# EAGLE design Programmer Board v1 Tests (EAGLE 9.4.2)
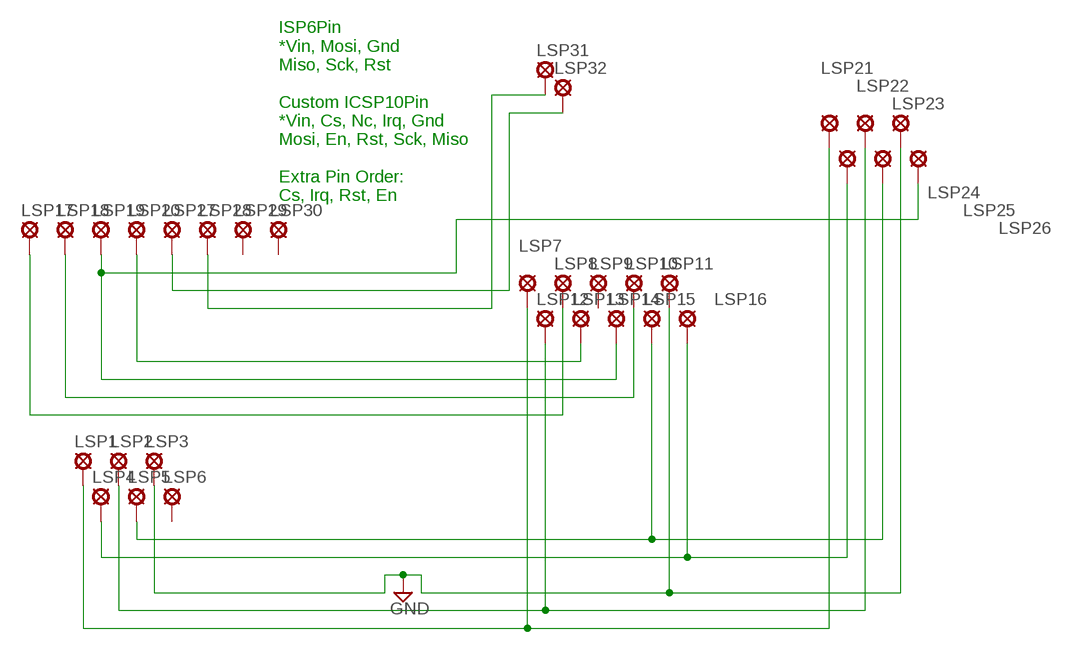
[diagram p0: schematic, sheet 1]

## Parts
LSP1  LSP10_CLSP10_C  [LSP10_C]
LSP2  LSP10_CLSP10_C  [LSP10_C]
LSP3  LSP10_CLSP10_C  [LSP10_C]
LSP4  LSP10_CLSP10_C  [LSP10_C]
LSP5  LSP10_CLSP10_C  [LSP10_C]
LSP6  LSP10_CLSP10_C  [LSP10_C]
LSP7  LSP10_CLSP10_C  [LSP10_C]
LSP8  LSP10_CLSP10_C  [LSP10_C]
LSP9  LSP10_CLSP10_C  [LSP10_C]
LSP10  LSP10_CLSP10_C  [LSP10_C]
LSP11  LSP10_CLSP10_C  [LSP10_C]
LSP12  LSP10_CLSP10_C  [LSP10_C]
LSP13  LSP10_CLSP10_C  [LSP10_C]
LSP14  LSP10_CLSP10_C  [LSP10_C]
LSP15  LSP10_CLSP10_C  [LSP10_C]
LSP16  LSP10_CLSP10_C  [LSP10_C]
LSP17  LSP10_CLSP10_C  [LSP10_C]
LSP18  LSP10_CLSP10_C  [LSP10_C]
LSP19  LSP10_CLSP10_C  [LSP10_C]
LSP20  LSP10_CLSP10_C  [LSP10_C]
LSP21  LSP10_CLSP10_C  [LSP10_C]
LSP22  LSP10_CLSP10_C  [LSP10_C]
LSP23  LSP10_CLSP10_C  [LSP10_C]
LSP24  LSP10_CLSP10_C  [LSP10_C]
LSP25  LSP10_CLSP10_C  [LSP10_C]
LSP26  LSP10_CLSP10_C  [LSP10_C]
LSP27  LSP10_CLSP10_C  [LSP10_C]
LSP28  LSP10_CLSP10_C  [LSP10_C]
LSP29  LSP10_CLSP10_C  [LSP10_C]
LSP30  LSP10_CLSP10_C  [LSP10_C]
LSP31  LSP10_CLSP10_C  [LSP10_C]
LSP32  LSP10_CLSP10_C  [LSP10_C]

## Nets
GND: LSP3.P$1(MP) LSP11.P$1(MP) LSP23.P$1(MP)
N$1: LSP1.P$1(MP) LSP7.P$1(MP) LSP21.P$1(MP)
N$2: LSP2.P$1(MP) LSP12.P$1(MP) LSP22.P$1(MP)
N$3: LSP27.P$1(MP) LSP32.P$1(MP)
N$4: LSP4.P$1(MP) LSP16.P$1(MP) LSP24.P$1(MP)
N$5: LSP5.P$1(MP) LSP15.P$1(MP) LSP25.P$1(MP)
N$6: LSP13.P$1(MP) LSP20.P$1(MP)
N$7: LSP14.P$1(MP) LSP19.P$1(MP) LSP26.P$1(MP)
N$8: LSP10.P$1(MP) LSP18.P$1(MP)
N$9: LSP8.P$1(MP) LSP17.P$1(MP)
N$10: LSP28.P$1(MP) LSP31.P$1(MP)
Unconnected: LSP6.P$1(MP) LSP9.P$1(MP) LSP29.P$1(MP) LSP30.P$1(MP)

## Notes on the sheet
- ISP6Pin
  *Vin, Mosi, Gnd
  Miso, Sck, Rst
  
  Custom ICSP10Pin
  *Vin, Cs, Nc, Irq, Gnd
  Mosi, En, Rst, Sck, Miso
  
  Extra Pin Order:
  Cs, Irq, Rst, En

## Library data of the parts
LSP1-LSP32 = tbtaco-solpad:LSP10_C: SOLDER PAD drill 1.0 mm, distributor Buerklin, 12H555

## Board
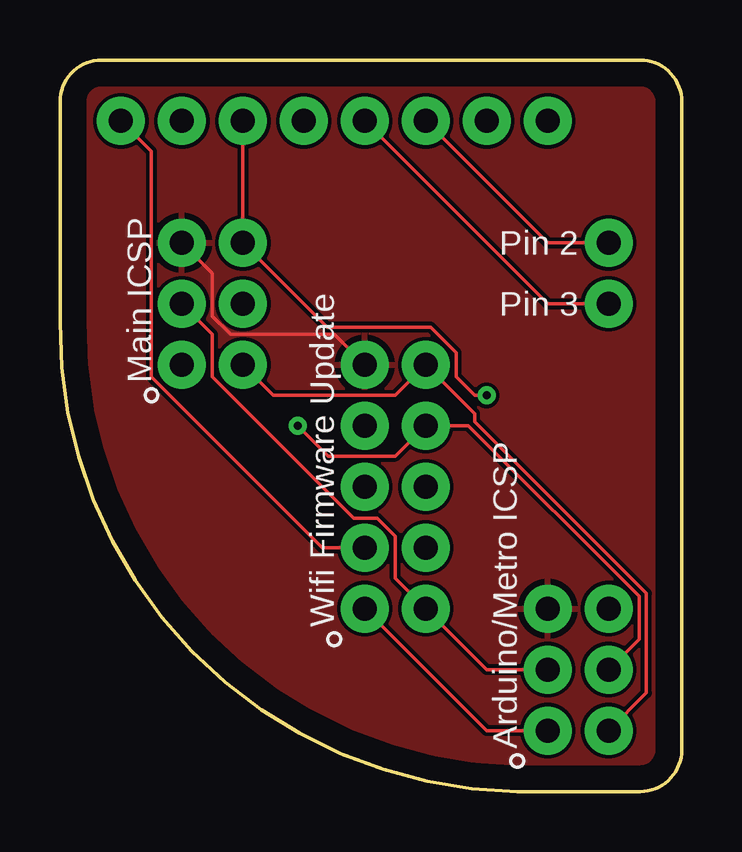
[diagram p1: board, top side]
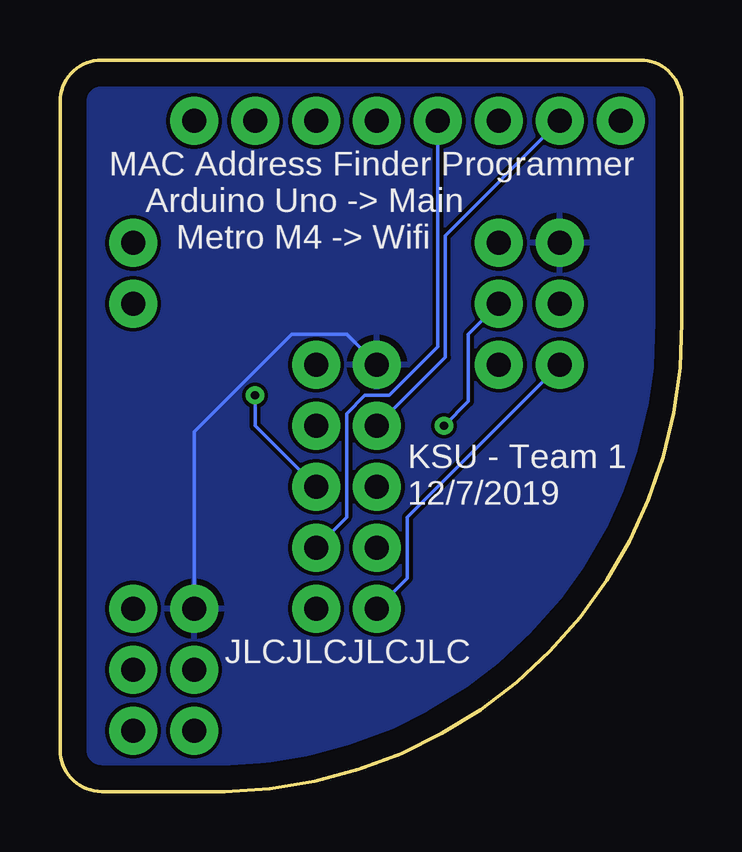
[diagram p2: board, bottom side, seen from below]

Size 25.91 x 30.48 mm. Coordinates in mm from the lower left corner, seen from the top.
Outline: 1.73,30.48 24.17,30.48 arc-90 25.91,28.75 25.91,1.73 arc-90 24.17,0 19.05,0 arc-90 0,19.56 0,28.75 arc-90 1.73,30.48
Copper layers (1*16): Top 0.035mm / dielectric 1.5mm / Bottom 0.035mm
Design rules "default": minimum track width 6mil, minimum drill 0.35mm, track to track 6mil, track to pad 6mil, pad to pad 6mil, via to via 6mil, smd to smd 6mil, copper to edge 40mil, drill to drill 6mil, minimum pad ring 10mil, minimum via ring 8mil, stop-mask expansion 4mil, vias tented up to drill 0mil, thermal gap 10mil

### Footprints (pad centres in the part's own frame; a part is rotated, then mirrored left to right if it is on the bottom)
LSP10_C = drill 1 pad 2: P$1 0,0

### Placement (x,y rotation side)
LSP1  20.32,2.54 0 top
LSP2  20.32,5.08 0 top
LSP3  20.32,7.62 0 top
LSP4  22.86,2.54 0 top
LSP5  22.86,5.08 0 top
LSP6  22.86,7.62 0 top
LSP7  12.7,7.62 0 top
LSP8  12.7,10.16 0 top
LSP9  12.7,12.7 0 top
LSP10  12.7,15.24 0 top
LSP11  12.7,17.78 0 top
LSP12  15.24,7.62 0 top
LSP13  15.24,10.16 0 top
LSP14  15.24,12.7 0 top
LSP15  15.24,15.24 0 top
LSP16  15.24,17.78 0 top
LSP17  2.54,27.94 0 top
LSP18  5.08,27.94 0 top
LSP19  7.62,27.94 0 top
LSP20  10.16,27.94 0 top
LSP21  5.08,17.78 0 top
LSP22  5.08,20.32 0 top
LSP23  5.08,22.86 0 top
LSP24  7.62,17.78 0 top
LSP25  7.62,20.32 0 top
LSP26  7.62,22.86 0 top
LSP27  12.7,27.94 0 top
LSP28  15.24,27.94 0 top
LSP29  17.78,27.94 0 top
LSP30  20.32,27.94 0 top
LSP31  22.86,22.86 0 top
LSP32  22.86,20.32 0 top

### Tracks (layer width: path | path; a pad name or v marks a point on that pad's centre or on a via)
GND
  Top 0.152: LSP23.P$1 6.35,21.59 6.35,19.81 7.11,19.05 11.43,19.05 LSP11.P$1
  Bottom 0.152: LSP11.P$1 13.97,19.05 16.26,19.05 20.32,14.99 LSP3.P$1
  pour Top: 0,30.48 25.91,30.48 25.91,0 14.99,0 13.72,1.27 12.7,1.27 12.19,1.78 11.18,1.78 10.16,2.79 9.4,2.79 8.13,4.06 7.62,4.06 2.54,9.14 2.54,10.16 1.52,11.18 1.52,12.7 0.76,13.46 0.76,14.73 0,15.49 0,18.54
  pour Bottom: 0,30.48 25.91,30.48 25.91,0 14.99,0 13.72,1.27 12.7,1.27 12.19,1.78 11.18,1.78 10.16,2.79 9.4,2.79 8.13,4.06 7.62,4.06 2.54,9.14 2.54,10.16 1.52,11.18 1.52,12.7 0.76,13.46 0.76,14.73 0,15.49
N$1
  Top 0.152: LSP1.P$1 17.78,2.54 LSP7.P$1
  Bottom 0.152: LSP21.P$1 11.43,11.43 11.43,8.89 LSP7.P$1
N$2
  Top 0.152: LSP2.P$1 17.78,5.08 LSP12.P$1 13.97,8.89 13.97,10.63 13.93,10.67 13.82,10.77 13.21,11.39 12.23,11.39 6.35,17.27 6.35,19.05 LSP22.P$1
N$3
  Top 0.152: LSP27.P$1 20.32,20.32 LSP32.P$1
N$4
  Top 0.152: LSP4.P$1 24.44,4.11 24.44,8.25 17.27,15.42 17.27,15.75 LSP16.P$1 13.97,16.51 8.89,16.51 LSP24.P$1
N$5  (via drill 0.35)
  Top 0.152: LSP5.P$1 24.13,6.35 24.13,8.13 17.02,15.24 LSP15.P$1 13.97,13.97 11.18,13.97 v9.91,15.24
  Bottom 0.152: LSP25.P$1 8.89,19.05 8.89,16.26 v9.91,15.24
N$6
  Bottom 0.152: LSP20.P$1 10.16,18.54 12.19,16.51 13.21,16.51 13.97,15.75 13.97,11.43 LSP13.P$1
N$7  (via drill 0.35)
  Top 0.152: LSP19.P$1 LSP26.P$1 11.12,19.36 15.44,19.36 16.51,18.29 16.51,17.27 17.27,16.51 v17.78,16.51
  Bottom 0.152: LSP14.P$1 17.78,15.24 v17.78,16.51
N$8
  Bottom 0.152: LSP10.P$1 9.86,18.08 9.86,23.16 LSP18.P$1
N$9
  Top 0.152: LSP17.P$1 3.81,26.67 3.81,17.27 10.92,10.16 LSP8.P$1
N$10
  Top 0.152: LSP28.P$1 20.32,22.86 LSP31.P$1

### Text on the board
tPlace: Pin 2 | Pin 3 | Main ICSP | Wifi Firmware Update | Arduino/Metro ICSP
bPlace: MAC Address Finder Programmer | Arduino Uno -> Main | Metro M4 -> Wifi | KSU - Team 1 | 12/7/2019 | JLCJLCJLCJLC